# EAGLE design LPC_4TE_3.43_dual (EAGLE 5.04)
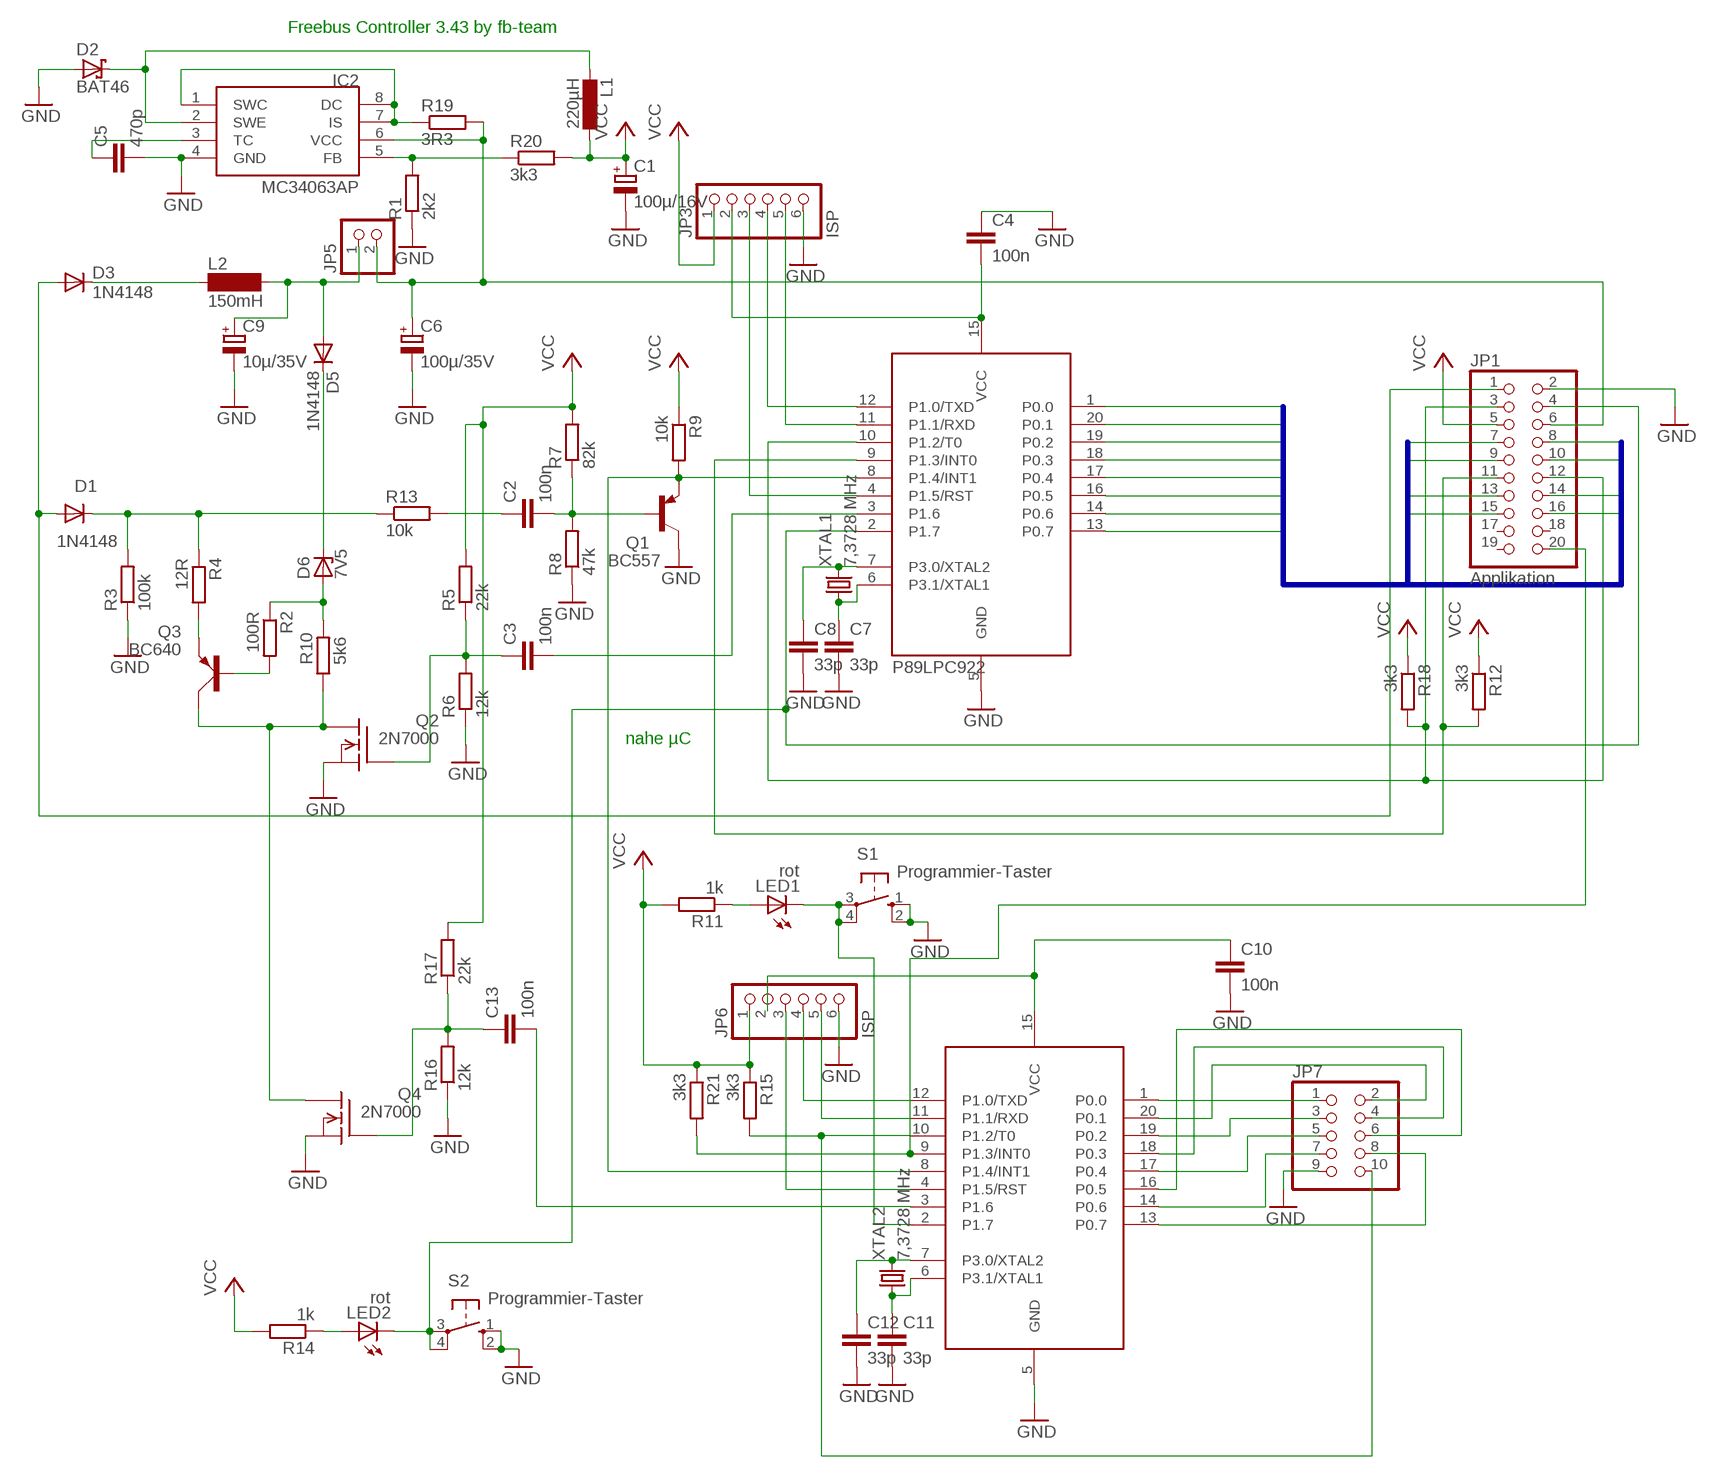
[diagram p0: schematic, sheet 1]

## Parts
C1  100µ/16V  CPOL-EUE5-8.5  [E5-8,5]
C2  100n  C-EU050-024X044  [C050-024X044]
C3  100n  C-EU050-024X044  [C050-024X044]
C4  100n  C-EU050-024X044  [C050-024X044]
C5  470p  C-EU025-024X044  [C025-024X044]
C6  100µ/35V  CPOL-EUE5-8.5  [E5-8,5]
C7  33p  C-EU025-024X044  [C025-024X044]
C8  33p  C-EU025-024X044  [C025-024X044]
C9  10µ/35V  CPOL-EUE5-8.5  [E5-8,5]
C10  100n  C-EU050-024X044  [C050-024X044]
C11  33p  C-EU025-024X044  [C025-024X044]
C12  33p  C-EU025-024X044  [C025-024X044]
C13  100n  C-EU050-024X044  [C050-024X044]
D1  1N4148  [DO35-10]
D2  BAT46  BAT49  [DO41-10]
D3  1N4148  [DO35-10]
D5  1N4148  [DO35-10]
D6  7V5  ZENER-DIODEZD-2.5  [ZDIO-2.5]
IC1  89LPC922  [DIL20]
IC2  MC34063AP  [DIL08]
IC3  89LPC922  [DIL20]
JP1  Applikation  PINHD-2X10  [2X10]
JP3  ISP  PINHD-1X6  [1X06]
JP5  PINHD-1X2  [1X02]
JP6  ISP  PINHD-1X6  [1X06]
JP7  PINHD-2X5  [2X05]
L1  220µH  L-EU2200-12.7  [2200-12.7]
L2  150mH  SD12-1000  [SD12_1000]
LED1  rot  LED3MM  [LED3MM]
LED2  rot  LED3MM  [LED3MM]
Q1  BC557  [TO92]
Q2  2N7000  VN2222KM  [TO237]
Q3  BC640  [SOT54D]
Q4  2N7000  VN2222KM  [TO237]
R1  2k2  R-EU_0207/10  [0207/10]
R2  100R  R-EU_0207/2V  [0207/2V]
R3  100k  R-EU_0207/2V  [0207/2V]
R4  12R  R-EU_0207/2V  [0207/2V]
R5  22k  R-EU_0207/2V  [0207/2V]
R6  12k  R-EU_0207/2V  [0207/2V]
R7  82k  R-EU_0207/2V  [0207/2V]
R8  47k  R-EU_0207/2V  [0207/2V]
R9  10k  R-EU_0207/2V  [0207/2V]
R10  5k6  R-EU_0207/2V  [0207/2V]
R11  1k  R-EU_0207/2V  [0207/2V]
R12  3k3  R-EU_0207/2V  [0207/2V]
R13  10k  R-EU_0207/2V  [0207/2V]
R14  1k  R-EU_0204/7  [0204/7]
R15  3k3  R-EU_0207/2V  [0207/2V]
R16  12k  R-EU_0207/2V  [0207/2V]
R17  22k  R-EU_0207/2V  [0207/2V]
R18  3k3  R-EU_0207/2V  [0207/2V]
R19  3R3  R-EU_0207/10  [0207/10]
R20  3k3  R-EU_0207/10  [0207/10]
R21  3k3  R-EU_0207/2V  [0207/2V]
S1  Programmier-Taster  10-XX  [B3F-10XX]
S2  Programmier-Taster  10-XX  [B3F-10XX]
XTAL1  7,3728 MHz  CRYSTALHC49S  [HC49/S]
XTAL2  7,3728 MHz  CRYSTALHC49S  [HC49/S]

## Nets
GND: C1.- C4.1 C5.2 C6.- C7.2 C8.2 C9.- C10.2 C11.2 C12.2 D2.A IC1.5(GND) IC2.4(GND) IC3.5(GND) JP1.2 JP3.6 JP6.6 JP7.9 Q1.3(C) Q2.3(S) Q4.3(S) R1.1 R3.1 R6.1 R8.1 R16.1 S1.1(S) S1.2(S1) S2.1(S) S2.2(S1)
INT1: IC1.8(P1.4/INT1) IC3.8(P1.4/INT1) Q1.1(E) R9.2
N$1: IC3.2(P1.7) LED1.K(C) S1.3(P) S1.4(P1)
N$2: C2.2 Q1.2(B) R7.1 R8.2
N$3: IC2.5(FB) R1.2 R20.1
N$4: IC2.1(SWC) IC2.7(IS) IC2.8(DC) R19.1
N$5: C3.2 IC1.3(P1.6)
N$6: Q2.1(D) Q3.C Q4.1(D) R10.1
N$7: C6.+ IC2.6(VCC) JP1.6 JP5.2 R19.2
N$8: D3.C L2.1
N$9: D1.C R3.2 R4.1 R13.1
N$10: D2.C IC2.2(SWE) L1.2
N$11: D6.A R2.1 R10.2
N$12: Q3.E R4.2
N$13: C5.1 IC2.3(TC)
N$14: Q3.B R2.2
N$15: IC1.9(P1.3/INT0) JP1.11 R12.2
N$16: D1.A D3.A JP1.1
N$17: IC3.9(P1.3/INT0) JP1.20 R21.2
N$18: C2.1 R13.2
N$20: C8.1 IC1.7(P3.0/XTAL2) XTAL1.2
N$21: C7.1 IC1.6(P3.1/XTAL1) XTAL1.1
N$22: LED2.A R14.1
N$23: IC1.2(P1.7) JP1.4 LED2.K(C) S2.3(P) S2.4(P1)
N$24: C12.1 IC3.7(P3.0/XTAL2) XTAL2.2
N$25: C11.1 IC3.6(P3.1/XTAL1) XTAL2.1
N$26: C10.1 IC3.15(VCC) JP6.2
N$29: IC1.12(P1.0/TXD) JP3.4
N$30: IC1.11(P1.1/RXD) JP3.5
N$31: IC1.4(P1.5/RST) JP3.3
N$32: C4.2 IC1.15(VCC) JP3.2
N$33: IC1.10(P1.2/T0) JP1.3 JP1.12 R18.2
N$34: C3.1 Q2.2(G) R5.1 R6.2
N$36: IC3.1(P0.0) JP7.1
N$37: IC3.20(P0.1) JP7.2
N$38: IC3.19(P0.2) JP7.3
N$39: IC3.18(P0.3) JP7.4
N$40: D5.C D6.C
N$41: LED1.A R11.1
N$42: IC3.17(P0.4) JP7.5
N$44: IC3.16(P0.5) JP7.6
N$45: IC3.14(P0.6) JP7.7
N$46: IC3.13(P0.7) JP7.8
N$47: IC3.10(P1.2/T0) JP7.10 R15.2
N$48: C13.2 IC3.3(P1.6)
N$49: C13.1 Q4.2(G) R16.2 R17.1
N$51: C9.+ D5.A JP5.1 L2.2
P0.0: IC1.1(P0.0) JP1.7
P0.1: IC1.20(P0.1) JP1.8
P0.2: IC1.19(P0.2) JP1.9
P0.3: IC1.18(P0.3) JP1.10
P0.4: IC1.17(P0.4) JP1.13
P0.5: IC1.16(P0.5) JP1.14
P0.6: IC1.14(P0.6) JP1.15
P0.7: IC1.13(P0.7) JP1.16
RST2: IC3.4(P1.5/RST) JP6.3
RX2: IC3.11(P1.1/RXD) JP6.5
TX2: IC3.12(P1.0/TXD) JP6.4
VCC: C1.+ JP1.5 JP3.1 JP6.1 L1.1 R5.2 R7.2 R9.1 R11.2 R12.1 R14.2 R15.1 R17.2 R18.1 R20.2 R21.1
Unconnected: JP1.17 JP1.18 JP1.19

## Buses
P0.[0..7]

## Notes on the sheet
- Freebus Controller 3.43 by fb-team
- P89LPC922
- nahe µC

## Library data of the parts
C1 C6 C9 = rcl:CPOL-EU: POLARIZED CAPACITOR, European symbol
C2-C5 C7 C8 C10-C13 = rcl:C-EU: CAPACITOR, European symbol
D1 D3 D5 = diode:1N4148: DIODE high speed (Philips)
D2 = diode:BAT49: DIODE small signal diode
D6 = diode:ZENER-DIODE: Z-Diode
IC1 IC3 = micro-philips:89LPC922
IC2 = mc34063:MC34063
JP1 = pinhead:PINHD-2X10: PIN HEADER
JP3 JP6 = pinhead:PINHD-1X6: PIN HEADER
JP5 = pinhead:PINHD-1X2: PIN HEADER
JP7 = pinhead:PINHD-2X5: PIN HEADER
L1 = rcl:L-EU: INDUCTOR, European symbol
L2 = inductor-neosid:SD12: INDUCTOR nominal inductance
LED1 LED2 = led:LED: LED OSRAM: - CHIPLED LG R971, LG N971, LY N971, LG Q971, LY Q971, LO R971, LY R971 LH N974, LH R974 LS Q976, LO Q976, LY Q976 LO Q996 - Hyper CHIPLED LW Q18S LB Q993, LB Q99A, LB R99A - SideLED LS A670, LO A670, LY A670, LG A670, LP A670 LB A673, LV A673, LT A673, LW A673 LH A674 LY A675 LS A676, LA A676, LO A676, LY A676, LW A676 LS A679, LY A679, LG A679 - Hyper Micro SIDELED® LS Y876, LA Y876, LO Y876, LY Y876 LT Y87S - SmartLED LW L88C, LW L88S LB L89C, LB L89S, LG L890 LS L89K, LO L89K, LY L89K LS L896, LA L896, LO L896, LY L896 - TOPLED LS T670, LO T670, LY T670, LG T670, LP T670 LSG T670, LSP T670, LSY T670, LOP T670, LYG T670 LG T671, LOG T671, LSG T671 LB T673, LV T673, LT T673, LW T673 LH T674 LS T676, LA T676, LO T676, LY T676, LB T676, LH T676, LSB T676, LW T676 LB T67C, LV T67C, LT T67C, LS T67K, LO T67K, LY T67K, LW E67C LS E67B, LA E67B, LO E67B, LY E67B, LB E67C, LV E67C, LT E67C LW T67C LS T679, LY T679, LG T679 LS T770, LO T770, LY T770, LG T770, LP T770 LB T773, LV T773, LT T773, LW T773 LH T774 LS E675, LA E675, LY E675, LS T675 LS T776, LA T776, LO T776, LY T776, LB T776 LHGB T686 LT T68C, LB T68C - Hyper Mini TOPLED® LB M676 - Mini TOPLED Santana® LG M470 LS M47K, LO M47K, LY M47K Source: http://www.osram.convergy.de - LUMILED® LXK2-PW12-R00, LXK2-PW12-S00, LXK2-PW14-U00, LXK2-PW14-V00 LXK2-PM12-R00, LXK2-PM12-S00, LXK2-PM14-U00 LXK2-PE12-Q00, LXK2-PE12-R00, LXK2-PE12-S00, LXK2-PE14-T00, LXK2-PE14-U00 LXK2-PB12-K00, LXK2-PB12-L00, LXK2-PB12-M00, LXK2-PB14-N00, LXK2-PB14-P00, LXK2-PB14-Q00 LXK2-PR12-L00, LXK2-PR12-M00, LXK2-PR14-Q00, LXK2-PR14-R00 LXK2-PD12-Q00, LXK2-PD12-R00, LXK2-PD12-S00 LXK2-PH12-R00, LXK2-PH12-S00 LXK2-PL12-P00, LXK2-PL12-Q00, LXK2-PL12-R00 Source: www.luxeon.com
Q1 = transistor-pnp:BC557: PNP Transistor
Q2 Q4 = transistor-fet:VN2222KM: N-Channel Enhancement MOSFET (VMOS); 60V; 0,5A; 7,5Ohm
Q3 = transistor-small-signal:BC640: PNP TRANSISTOR
R1-R21 = rcl:R-EU_: RESISTOR, European symbol
S1 S2 = switch-omron:10-XX: OMRON SWITCH
XTAL1 XTAL2 = crystal:CRYSTAL: CRYSTAL

## Board
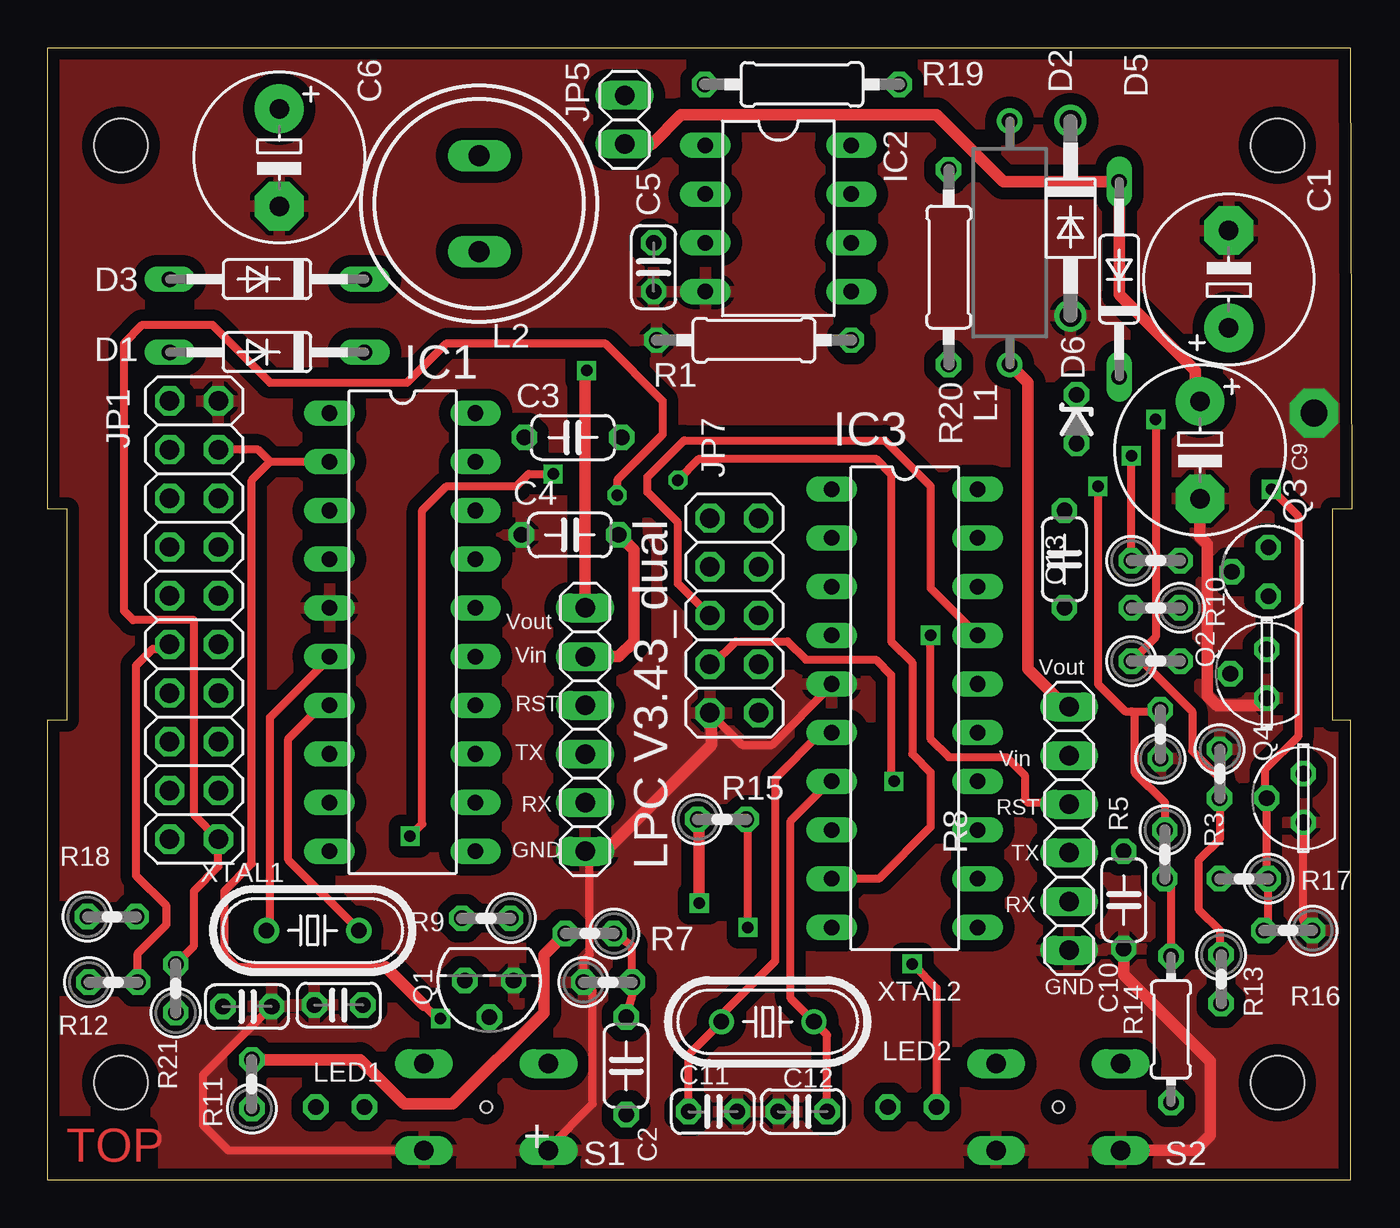
[diagram p1: board, top side]
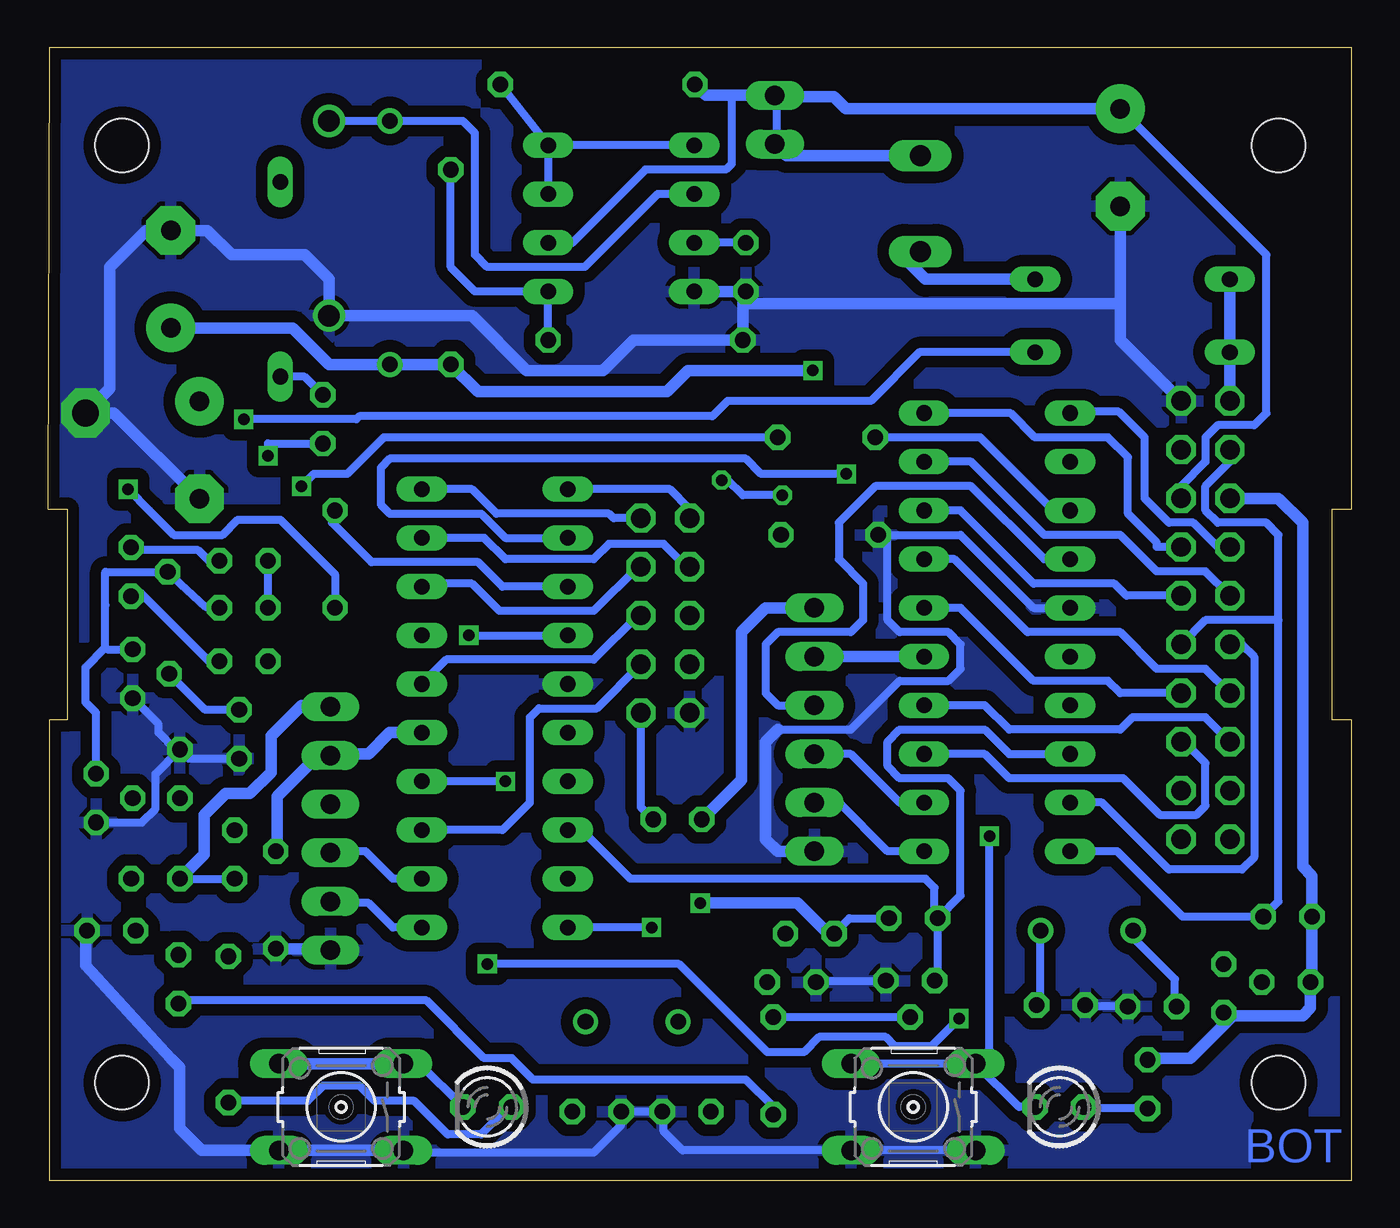
[diagram p2: board, bottom side, seen from below]

Size 68 x 59.05 mm. Coordinates in mm from the lower left corner, seen from the top.
Outline: 0,0 0,24 1,24 1,35 0,35 0,59.05 67.94,59.05 68,35.5 68,35 67,35 67,24 67.94,24 67.94,0 0,0
Copper layers (1*16): Top 0.035mm / dielectric 1.5mm / Bottom 0.035mm
Design rules "default *": minimum track width 10mil, minimum drill 24mil, track to track 12mil, track to pad 12mil, pad to pad 12mil, via to via 12mil, smd to smd 8mil, copper to edge 20mil, drill to drill 8mil, minimum pad ring 10mil, minimum via ring 8mil, stop-mask expansion 4mil, vias tented up to drill 0mil, thermal gap 10mil
Holes 2.8 mm at 3.81,53.98 64.14,53.98 64.14,5.08 3.81,5.08
Holes 0.6 mm at 52.7,3.81 22.86,3.81

### Footprints (pad centres in the part's own frame; a part is rotated, then mirrored left to right if it is on the bottom)
E5-8,5 = drill 1.016 pad 2.54 round: + -2.54,0 | drill 1.016 pad 2.54 octagon: - 2.54,0
C050-024X044 = drill 0.813 octagon: 1 -2.54,0; 2 2.54,0
C025-024X044 = drill 0.813 octagon: 1 -1.27,0; 2 1.27,0
DO35-10 = drill 0.813 long: A 5.08,0; C -5.08,0
DO41-10 = drill 1.118 round: A 5.08,0; C -5.08,0
ZDIO-2.5 = drill 0.813 octagon: A 1.27,0; C -1.27,0
DIL20 = drill 0.813 long: 1 -11.43,-3.81; 2 -8.89,-3.81; 3 -6.35,-3.81; 4 -3.81,-3.81; 5 -1.27,-3.81; 6 1.27,-3.81; 7 3.81,-3.81; 8 6.35,-3.81; 9 8.89,-3.81; 10 11.43,-3.81; 11 11.43,3.81; 12 8.89,3.81; 13 6.35,3.81; 14 3.81,3.81; 15 1.27,3.81; 16 -1.27,3.81; 17 -3.81,3.81; 18 -6.35,3.81; 19 -8.89,3.81; 20 -11.43,3.81
DIL08 = drill 0.813 long: 1 -3.81,-3.81; 2 -1.27,-3.81; 3 1.27,-3.81; 4 3.81,-3.81; 5 3.81,3.81; 6 1.27,3.81; 7 -1.27,3.81; 8 -3.81,3.81
2X10 = drill 1.016 octagon: 1 -11.43,-1.27; 2 -11.43,1.27; 3 -8.89,-1.27; 4 -8.89,1.27; 5 -6.35,-1.27; 6 -6.35,1.27; 7 -3.81,-1.27; 8 -3.81,1.27; 9 -1.27,-1.27; 10 -1.27,1.27; 11 1.27,-1.27; 12 1.27,1.27; 13 3.81,-1.27; 14 3.81,1.27; 15 6.35,-1.27; 16 6.35,1.27; 17 8.89,-1.27; 18 8.89,1.27; 19 11.43,-1.27; 20 11.43,1.27
1X06 = drill 1.016 long: 1 -6.35,0; 2 -3.81,0; 3 -1.27,0; 4 1.27,0; 5 3.81,0; 6 6.35,0
1X02 = drill 1.016 long: 1 -1.27,0; 2 1.27,0
2X05 = drill 1.016 octagon: 1 -5.08,-1.27; 2 -5.08,1.27; 3 -2.54,-1.27; 4 -2.54,1.27; 5 0,-1.27; 6 0,1.27; 7 2.54,-1.27; 8 2.54,1.27; 9 5.08,-1.27; 10 5.08,1.27
2200-12.7 = drill 0.8 pad 1.27 round: 1 -6.35,0; 2 6.35,0
SD12_1000 = drill 1.1 long: 1 -2.5,0; 2 2.5,0
LED3MM = drill 0.813 octagon: A -1.27,0; K 1.27,0
TO92 = drill 0.813 octagon: 1 1.27,0; 2 0,1.905; 3 -1.27,0
TO237 = drill 0.813 octagon: 1 1.27,0; 2 0,1.905; 3 -1.27,0
SOT54D = drill 0.813 octagon: B 1.27,0; C 0,1.905; E -1.27,0
0207/10 = drill 0.813 octagon: 1 -5.08,0; 2 5.08,0
0207/2V = drill 0.813 octagon: 1 -1.27,0; 2 1.27,0
0204/7 = drill 0.813 octagon: 1 -3.81,0; 2 3.81,0
B3F-10XX = drill 1.016 long: 1 -3.251,2.261; 2 3.251,2.261; 3 -3.251,-2.261; 4 3.251,-2.261
HC49/S = drill 0.813 round: 1 -2.413,0; 2 2.413,0

### Placement (x,y rotation side)
C1  61.59,46.99 90 top
C2  30.16,5.95 90 top
C3  27.38,38.73 180 top
C4  27.23,33.66 0 top
C5  31.59,47.62 270 top
C6  12.06,53.34 270 top
C7  10.4,9.05 0 top
C8  15.16,9.13 180 top
C9  60.09,38.08 270 top
C10  56.12,14.61 270 top
C11  34.69,3.57 0 top
C12  39.37,3.57 180 top
C13  53.02,32.39 90 top
D1  11.43,43.18 180 top
D2  53.34,50.16 270 top
D3  11.43,46.99 180 top
D5  55.88,46.99 90 top
D6  53.66,39.69 270 top
IC1  18.49,28.57 270 top
IC2  38.1,50.16 270 top
IC3  44.69,24.61 270 top
JP1  7.62,29.21 270 top
JP3  28.02,23.5 270 top
JP5  30.08,55.31 90 top
JP6  53.26,18.34 270 top
JP7  35.8,29.45 270 top
L1  50.16,48.9 90 top
L2  22.5,50.94 90 top
LED1  15.24,3.81 180 bottom
LED2  45.09,3.81 180 bottom
Q1  23.02,10.4 180 top
Q2  63.58,26.41 90 top
Q3  63.66,31.73 90 top
Q4  65.48,19.92 90 top
R1  36.83,43.81 0 top
R2  57.79,32.31 0 top
R3  61.12,21.19 270 top
R4  57.78,27.07 0 top
R5  58.26,16.99 270 top
R6  58.02,23.26 90 top
R7  28.26,12.86 180 top
R8  29.21,10.32 0 top
R9  22.86,13.65 180 top
R10  57.78,29.84 180 top
R11  10.64,5 90 top
R12  3.41,10.32 0 top
R13  61.2,10.48 270 top
R14  58.58,7.86 90 top
R15  35.16,18.81 0 top
R16  64.69,13.02 180 top
R17  62.39,15.72 180 top
R18  3.33,13.73 0 top
R19  39.33,57.15 180 top
R20  46.99,47.62 270 top
R21  6.67,10 90 top
S1  22.86,3.81 180 bottom
S2  52.7,3.81 180 bottom
XTAL1  13.81,13.02 0 top
XTAL2  37.54,8.26 0 top

### Tracks (layer width: path | path; a pad name or v marks a point on that pad's centre or on a via)
GND  (via drill 1.4 pad 2.54)
  Top 0.406: S1.1 9.4,1.55 8.1,2.86 8.1,5.48 C7.2 | IC3.5 40.88,25.8 37.78,22.7 36.2,22.7 JP7.9 34.53,23.65 | JP3.6 28.26,16.91 28.26,11.75 27.94,11.43 R8.1 28.42,9.84 28.42,3.97 26.11,1.66 S1.2 | Q4.3 65.48,13.49 R16.1
  Top 0.61: JP3.6 29.05,17.14 34.61,22.7 34.61,23.57 34.53,23.65 | C9.- 60.09,33.57 60.48,33.18 60.48,25.24 60.96,24.77 63.21,24.77 Q2.3 | C10.2 56.12,10.72 60.64,6.19 60.64,2.34 59.85,1.55 S2.2
  Bottom 0.406: 29.92,23.5 26.11,23.5 23.57,26.04 21.03,26.04 20.4,26.67 20.4,27.94 21.03,28.57 23.57,28.57 24.21,29.21 24.21,33.66 20.4,33.66 16.59,29.84 IC1.5 | C7.2 13.81,9.05 C8.2 | Q1.3 27.86,10.4 R8.1 | JP3.6 28.26,16.91 | S1.1 S1.2 34.89,1.55 35.88,2.54 35.88,3.49 C11.2 C12.2 38.1,2.86 39.53,1.43 49.33,1.43 | R3.1 61.36,22.46 62.23,23.34 62.23,23.79 Q2.3 | R6.1 60.64,21.99 R3.1 | Q4.3 63.1,18.65 62.39,19.37 62.39,21.19 R3.1
  Bottom 0.61: JP1.2 12.06,43.81 12.06,45.72 | 12.06,45.72 C6.- | 29.92,23.5 30.56,22.86 30.56,17.78 29.92,17.14 JP3.6 | IC2.4 C5.2 31.75,45.72 | 31.75,45.72 R1.1 37.47,43.81 39.05,42.23 43.02,42.23 45.88,45.09 D2.A 53.34,46.99 54.61,48.26 58.42,48.26 59.69,49.53 C1.- 62.87,49.53 64.77,47.62 64.77,41.27 v66.04,40.01 64.56,40.01 C9.- | 31.75,45.72 12.06,45.72 | 24.21,33.66 C4.1 | R16.1 66.04,12.94 66.04,11.19 61.59,6.35 61.12,5.87 61.12,2.7 59.97,1.55 S2.2 S2.1 49.33,1.43 | C10.2 53.34,12.06 JP6.6
  pour Bottom (isolate 0.61): -0.32,59.37 -0.32,-0.64 68.58,-0.64 68.58,59.53 2.22,59.53
  pour Top (isolate 0.61): -0.32,59.37 -0.32,-0.48 68.42,-0.48 68.42,59.37 0.48,59.37
INT1
  Bottom 0.406: IC1.8 17.86,22.23 19.13,23.5 23.57,23.5 24.21,22.86 24.21,21.59 23.57,20.95 21.03,20.95 20.4,20.32 20.4,14.84 R9.2 | R9.2 21.59,10.56 Q1.1 | IC3.8 40.16,18.26 37.62,15.72 22.23,15.72 21.75,15.24 21.75,13.81 R9.2
N$1  (via drill 0.6)
  Top 0.406: v26.35,36.83 25.08,36.83 24.45,36.2 20.8,36.2 19.53,34.92 19.53,18.57 v18.89,17.94
  Bottom 0.406: LED1.K 17.35,3.81 S1.3 | S1.3 S1.4 | IC3.2 44.13,33.5 45.4,34.77 50.16,34.77 50.64,35.24 50.64,37.15 50.16,37.62 31.59,37.62 30.8,36.83 v26.35,36.83 | v18.89,17.94 18.89,6.79 S1.3
N$2
  Top 0.406: C2.2 30.64,10.16 R8.2 30.48,12.22 R7.1
  Bottom 0.406: Q1.2 29.69,8.49 C2.2
N$3
  Bottom 0.406: R1.2 IC2.5 45.72,46.35 46.99,47.62 R20.1
N$4
  Bottom 0.406: IC2.1 IC2.8 | IC2.8 IC2.7 | IC2.8 R19.1
N$5
  Bottom 0.406: IC1.3 15.56,34.92 19.37,38.73 C3.2
N$6
  Bottom 0.406: R10.1 59.03,29.9 59.77,29.9 Q3.C 65.01,31.73 65.01,29.98 65.01,27.78 | Q4.1 65.48,24.37 66.04,24.92 66.04,26.75 65.01,27.78 | Q2.1 64.91,27.68 65.01,27.78
N$7
  Bottom 0.406: JP1.6 8.89,36.2 7.62,37.47 7.62,38.73 6.99,39.37 5.08,39.37 4.45,40.01 4.45,48.26 C6.+ | IC2.6 40.64,48.9 36.83,52.7 32.64,52.7 32.34,53 32.34,56.58 | 30,56.5 30,54
  Bottom 0.61: C6.+ 26.38,55.88 27,56.5 30,56.5 JP5.2 32.34,56.58 33.68,56.58 R19.2
N$8
  Bottom 0.61: D3.C 22.23,46.99 23.5,48.26 L2.1
N$9  (via drill 0.6)
  Top 0.406: v57.78,39.69 57.78,28.34 56.87,27.42 | 56.87,27.42 R4.1 | 56.87,27.42 57.15,27.15 57.15,26.99 59.69,24.45 59.69,22.38 61.12,20.95 R3.2 61.12,17.78 60.01,16.67 60.01,14.13 61.12,13.02 61.12,11.83 R13.1
  Bottom 0.406: D1.C 22.54,43.18 25.08,40.64 32.54,40.64 33.34,39.85 51.75,39.85 51.91,39.69 v57.78,39.69
N$10
  Bottom 0.406: IC2.2 36.2,51.44 40.01,47.62 45.09,47.62 45.72,48.26 45.72,54.61 46.35,55.24 L1.2 D2.C
N$11  (via drill 0.6)
  Top 0.406: R2.1 v56.52,37.78 | R2.1
  Bottom 0.406: R10.2 R2.1 | D6.A 56.52,38.42 v56.52,37.78
N$12
  Bottom 0.406: R4.2 59.61,27.07 63.18,30.64 63.63,30.64 Q3.E
N$13
  Bottom 0.406: C5.1 IC2.3
N$14
  Bottom 0.406: R2.2 59.61,32.31 60.17,32.86 63.32,32.86 Q3.B
N$15
  Top 0.406: R12.2 4.68,11.83 6.19,13.34 6.19,14.29 4.6,15.88 4.6,26.83 5.48,27.7 6.11,27.7 JP1.11
  Bottom 0.406: JP1.11 5.71,27.94 5.08,27.3 5.08,16.83 5.71,16.19 9.53,16.19 13.02,19.68 IC1.9
N$16
  Bottom 0.61: JP1.1 D1.A D3.A
N$17  (via drill 0.6)
  Top 0.406: IC3.9 43.34,15.72 46.04,18.41 46.04,21.27 45.09,22.23 45.09,26.99 43.97,28.1 43.97,36.83 43.18,37.62 33.97,37.62 v32.86,36.51 | v29.69,35.72 29.69,36.51 32.07,38.89 32.07,40.64 29.05,43.66 20.8,43.66 18.73,41.59 11.59,41.59 8.57,44.61 4.92,44.61 3.97,43.66 3.97,29.69 4.45,29.21 7.62,29.21 7.62,19.05 JP1.20 8.89,16.35 7.62,15.08 7.62,12.22 R21.2
  Bottom 0.406: v32.86,36.51 32.54,36.51 31.75,35.72 v29.69,35.72
N$18
  Bottom 0.406: C2.1 30.16,3.81 31.59,5.24 42.7,5.24 43.81,6.35 45.24,6.35 48.26,9.37 61.04,9.37 R13.2
N$20
  Top 0.406: IC1.7 14.29,24.77 12.54,23.02 12.54,16.7 XTAL1.2
  Bottom 0.406: XTAL1.2 16.22,9.33 C8.1
N$21
  Top 0.406: IC1.6 14.68,27.23 11.59,24.13 11.59,13.21 XTAL1.1
  Bottom 0.406: XTAL1.1 11.4,12.67 9.21,10.48 9.21,9.13 C7.1
N$22
  Bottom 0.406: R14.1 58.5,4.13 54.45,4.13 53.66,4.92 51.75,4.92 50.96,4.13 48.9,4.13 47.15,2.38 45.4,2.38 43.97,3.81 LED2.A
N$23  (via drill 0.6)
  Top 0.406: JP1.4 10.95,38.1 11.59,37.47 | 11.59,37.47 IC1.2 | 17.62,11.11 9.84,11.11 9.21,11.75 9.21,15.08 10.64,16.51 10.64,36.51 11.59,37.47 | LED2.K 46.35,10 v45.09,11.27 | v20.48,8.41 20.32,8.41 19.61,9.12
  Top 0.61: 17.62,11.11 19.61,9.12
  Bottom 0.406: LED2.K 48.62,6.07 | v45.09,11.27 35.08,11.27 30.48,6.67 28.57,6.67 27.78,7.46 24.29,7.46 23.81,6.99 21.91,6.99 v20.48,8.41
  Bottom 0.61: 48.62,6.07 S2.3 S2.4
N$24
  Top 0.406: IC3.7 40.8,20.8 38.73,18.73 38.73,9.48 XTAL2.2 40.64,7.57 C12.1
N$25
  Top 0.406: IC3.6 40.32,23.34 37.94,20.95 37.94,11.43 35.08,8.57 35.08,8.3 XTAL2.1 33.42,6.54 C11.1
N$26
  Bottom 0.61: IC3.15 50.16,23.34 51.28,22.23 53.18,22.23 JP6.2 53.9,22.15 56.04,20 56.04,17.22 C10.1
N$29
  Bottom 0.406: IC1.12 23.57,19.68 26.11,22.23 JP3.4
N$30
  Bottom 0.406: IC1.11 24.21,17.14 26.75,19.68 JP3.5
N$31
  Bottom 0.406: JP3.3 29.92,24.77 30.56,25.4 30.56,27.94 29.92,28.57 26.11,28.57 25.48,29.21 25.48,31.11 26.75,32.38 26.75,34.29 24.84,36.2 19.84,36.2 16.03,32.38 IC1.4
N$32
  Top 0.61: C4.2 | C4.2 30.56,32.86 30.56,28.1 29.77,27.3 JP3.2
  Bottom 0.61: IC1.15 JP3.2
N$33
  Bottom 0.406: 3.81,29.21 7.62,29.21 JP1.12 | JP1.3 6.35,37.47 7.62,36.2 7.62,34.92 6.99,34.29 4.45,34.29 3.81,33.66 3.81,29.21 | 3.81,29.21 3.81,14.53 R18.2 8.81,13.73 12.22,17.14 IC1.10
N$34  (via drill 0.6)
  Top 0.406: v54.77,36.2 54.77,25.88 56.2,24.45 56.52,24.45 | 56.52,24.45 57.94,24.45 R6.2 | R5.1 58.26,19.68 56.67,21.27 56.67,24.29 56.52,24.45
  Bottom 0.406: R6.2 59.79,24.53 Q2.2 | C3.1 50.48,38.73 52.39,36.83 54.13,36.83 v54.77,36.2
N$36
  Bottom 0.406: JP7.1 34.53,35 35.56,36.04 IC3.1 | IC3.1
N$37
  Bottom 0.406: JP7.2 38.5,34.53 38.73,34.77 44.61,34.77 45.88,36.04 IC3.20 | IC3.20
N$38
  Bottom 0.406: JP7.3 34.69,31.99 35.88,33.18 38.73,33.18 39.53,32.38 44.13,32.38 45.24,33.5 IC3.19 | IC3.19
N$39
  Bottom 0.406: JP7.4 37.23,31.99 39.53,29.69 44.45,29.69 45.88,31.11 48.34,31.11 IC3.18
N$40
  Bottom 0.406: D5.C 54.61,41.91 D6.C
N$41
  Bottom 0.406: R11.1 13.89,3.73 LED1.A
N$42
  Top 0.406: JP7.5 | JP7.5 32.86,31.11 32.86,34.29 31.27,35.88 31.27,36.67 33.18,38.58 43.66,38.58 46.04,36.2 46.04,30.88 IC3.17
  Top 0.61: IC3.17
  Bottom 0.406: IC3.17
N$44
  Bottom 0.406: JP7.6 37.23,29.45 39.53,27.15 47.23,27.15 IC3.16
N$45  (via drill 0.6)
  Top 0.406: JP7.7 34.69,26.91 35.88,28.1 38.58,28.1 39.53,27.15 43.18,27.15 43.97,26.35 43.97,20.95 v44.13,20.8
  Bottom 0.406: v44.13,20.8 IC3.14 | IC3.14
N$46
  Bottom 0.406: JP7.8 | JP7.8 39.37,24.61 42.39,24.61 42.86,24.13 42.86,19.68 44.29,18.26 IC3.13 | IC3.13
N$47  (via drill 0.6)
  Top 0.406: v36.51,13.18 36.51,18.73 R15.2
  Bottom 0.406: JP7.10 37.07,19.45 R15.2 | IC3.10 | v36.51,13.18 IC3.10
N$48
  Bottom 0.406: IC3.3 44.29,30.96 45.56,32.23 51.12,32.23 53.18,34.29 53.18,34.77 C13.2
N$49  (via drill 0.6)
  Top 0.406: R16.2 63.66,13.26 R17.1 63.58,15.79 Q4.2 63.5,20 63.5,21.43 65.25,23.18 65.25,34.61 v63.82,36.04
  Bottom 0.406: C13.1 53.02,31.59 55.88,34.45 58.1,34.45 58.9,33.66 61.44,33.66 62.71,34.92 v63.82,36.04
N$51
  Top 0.61: JP5.1 31.5,54.04 33.02,55.56 46.35,55.56 49.85,52.07 D5.A 55.88,46.2 59.85,42.23 59.85,40.86 C9.+
  Bottom 0.61: L2.2 29.48,53.44 JP5.1
P0.0
  Bottom 0.406: JP1.7 6.99,33.02 8.26,34.29 9.53,34.29 10.79,35.56 10.79,38.73 12.14,40.08 14.61,40.08 IC1.1
P0.1
  Bottom 0.406: JP1.8 10.16,33.02 10.16,33.26 11.67,34.77 11.67,37.7 12.7,38.73 16.51,38.73 17.78,40.01 IC1.20
P0.2
  Bottom 0.406: JP1.9 7.62,31.75 10.16,31.75 12.06,33.66 16.03,33.66 19.84,37.47 IC1.19
P0.3
  Bottom 0.406: IC1.18 20.4,34.92 16.59,31.11 12.38,31.11 11.75,30.48 JP1.10
P0.4
  Bottom 0.406: JP1.13 7.62,26.67 10.16,26.67 12.06,28.57 16.91,28.57 20.72,32.38 IC1.17
P0.5
  Bottom 0.406: IC1.16 20.4,29.84 16.59,26.04 12.7,26.04 12.06,25.4 JP1.14
P0.6
  Bottom 0.406: JP1.15 7.62,24.13 11.43,24.13 12.06,23.5 17.86,23.5 19.13,24.77 IC1.14
P0.7
  Bottom 0.406: IC1.13 19.13,22.23 17.86,20.95 11.91,20.95 10,19.05 8.1,19.05 7.62,19.53 7.62,21.75 8.73,22.86 JP1.16
RST2  (via drill 0.6)
  Top 0.406: v46.04,28.42 46.04,23.02 46.99,22.07 50.01,22.07 50.96,21.11 50.96,19.84 51.12,19.68 53.18,19.68 JP6.3
  Bottom 0.406: IC3.4 v46.04,28.42
RX2
  Bottom 0.406: IC3.11 50.01,13.18 51.28,14.45 53.18,14.45 JP6.5
TX2
  Bottom 0.406: IC3.12 50.01,15.72 51.44,17.14 53.18,17.14 JP6.4
VCC  (via drill 0.6)
  Top 0.406: 57.94,15.72 R5.2 58.58,15.4 R14.2 | JP6.1 v53.34,24.77
  Top 0.61: 33.73,18.81 R15.1 33.97,18.73 v33.97,14.45 | R11.2 16.27,6.27 18.57,3.97 21.11,3.97 25.88,8.73 25.88,11.75 R7.2 | JP6.1 53.1,24.69 51.12,26.67 51.12,41.59 L1.1 | JP3.1 28.02,42.15 v28.1,42.23
  Bottom 0.406: R9.1 26.19,13.65 R7.2 | R17.2 R5.2 | R17.2 | R21.1 | 6.35,8.41 R21.1
  Bottom 0.61: JP3.1 30.56,29.84 31.83,28.57 31.83,20.88 R15.1 | C1.+ 55.24,44.45 53.34,42.55 L1.1 R20.2 45.56,41.12 35.72,41.12 34.61,42.23 v28.1,42.23 | JP1.5 3.81,35.56 2.54,34.29 2.54,16.35 2.06,15.88 R18.1 2.06,10.4 R12.1 2.14,8.97 2.54,8.57 6.19,8.57 6.35,8.41 8.41,6.35 10.56,6.35 R11.2 | R7.2 27.3,12.86 28.89,14.45 v33.97,14.45 | v53.34,24.77 54.77,24.77 56.36,23.18 56.36,21.27 57.47,20.16 58.74,20.16 59.85,19.05 59.85,16.99 R17.2

### Text on the board
Top: TOP
Bottom: BOT
tPlace: Vout | Vin | Vout | RST | TX | Vin | RX | RST | GND | TX | RX | GND | +
tNames: LPC V3.43_dual